# EAGLE design deska (EAGLE 7.7.0)
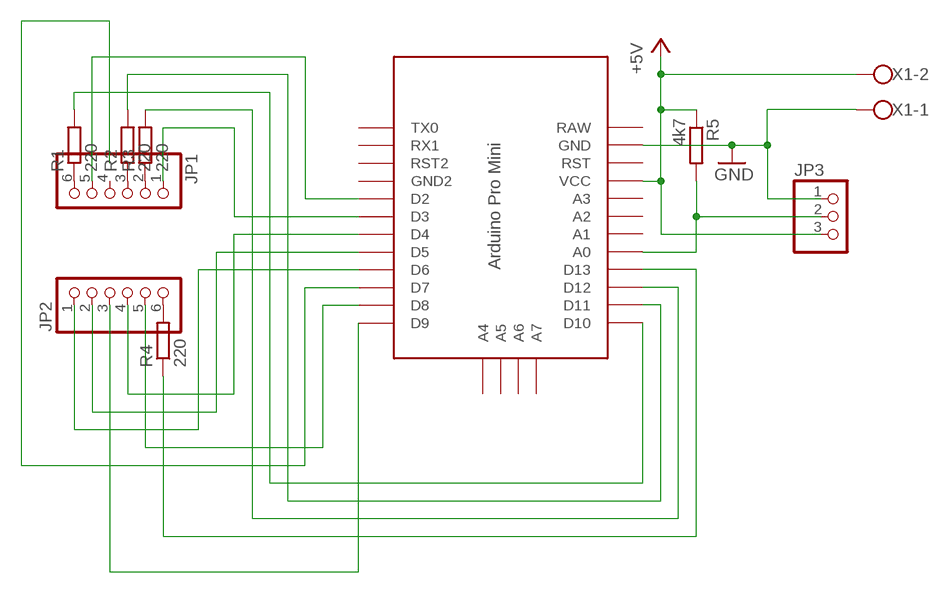
[diagram p0: schematic, sheet 1]

## Parts
JP1  PINHD-1X6  [1X06]
JP2  PINHD-1X6  [1X06]
JP3  PINHD-1X3  [1X03]
R1  220  R-EU_0204/7  [0204/7]
R2  220  R-EU_0204/7  [0204/7]
R3  220  R-EU_0204/7  [0204/7]
R4  220  R-EU_0204/7  [0204/7]
R5  4k7  R-EU_0204/7  [0204/7]
U$1  PRO-MINI  [PRO-MINI]
X1  W237-102  [W237-102]

## Nets
+5V: JP3.3 R5.1 U$1.VCC X1.2
GND: JP3.1 U$1.GND X1.1
N$1: JP1.6 R1.1
N$2: JP1.3 R2.1
N$3: JP1.2 R3.1
N$4: JP2.6 R4.2
N$5: R1.2 U$1.D10
N$6: R2.2 U$1.D11
N$7: R3.2 U$1.D12
N$8: R4.1 U$1.D13
N$9: JP1.5 U$1.D2
N$10: JP1.1 U$1.D3
N$11: JP2.4 U$1.D4
N$12: JP2.2 U$1.D5
N$13: JP2.1 U$1.D6
N$14: U$1.D7
N$15: JP2.5 U$1.D8
N$16: JP2.3 U$1.D9
N$17: JP3.2 R5.2 U$1.A0
Unconnected: JP1.4 U$1.A1 U$1.A2 U$1.A3 U$1.A4 U$1.A5 U$1.A6 U$1.A7 U$1.GND1(GND2) U$1.RST U$1.RST1(RST2) U$1.RX1 U$1.TX0

## Power pins joined to a net without a drawn wire
RAW: U$1.RAW

## Library data of the parts
JP1 JP2 = pinhead:PINHD-1X6: PIN HEADER
JP3 = pinhead:PINHD-1X3: PIN HEADER
R1-R5 = rcl:R-EU_: RESISTOR, European symbol
U$1 = Arduino-clone:PRO-MINI: Arduion Pro Mini Clone V1.0 www.betemcu.cu
X1 = con-wago-500:W237-102: WAGO SCREW CLAMP; MPN: 237-102; OC_FARNELL: unknown; OC_NEWARK: 70K9898

## Board
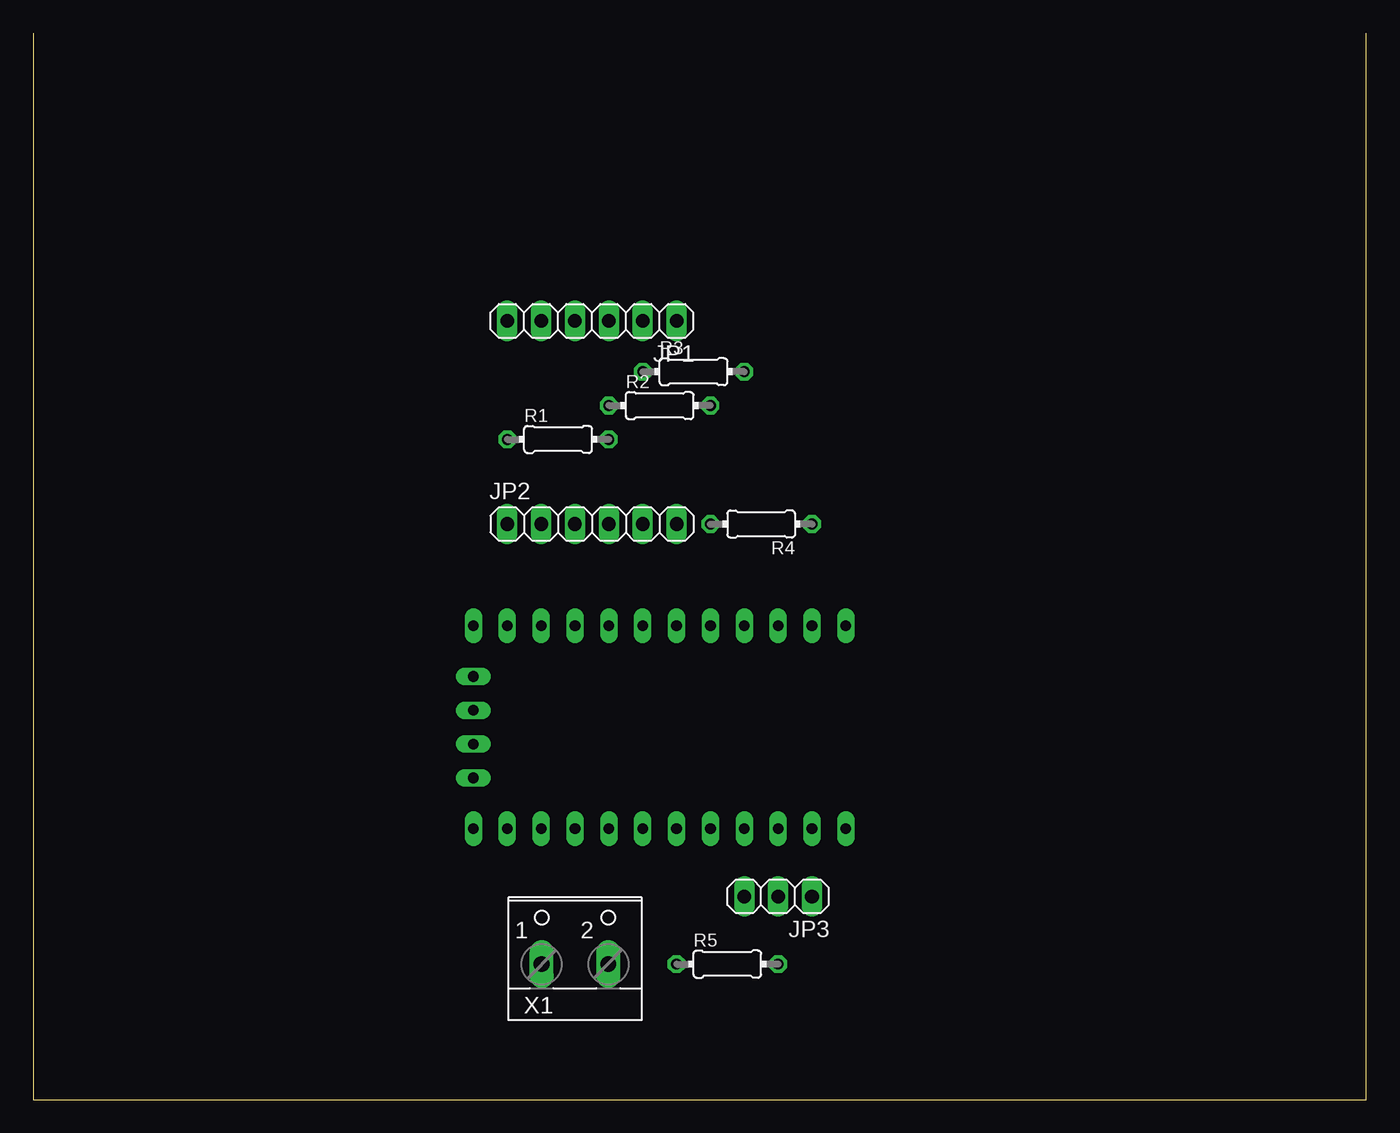
[diagram p1: board, top side]
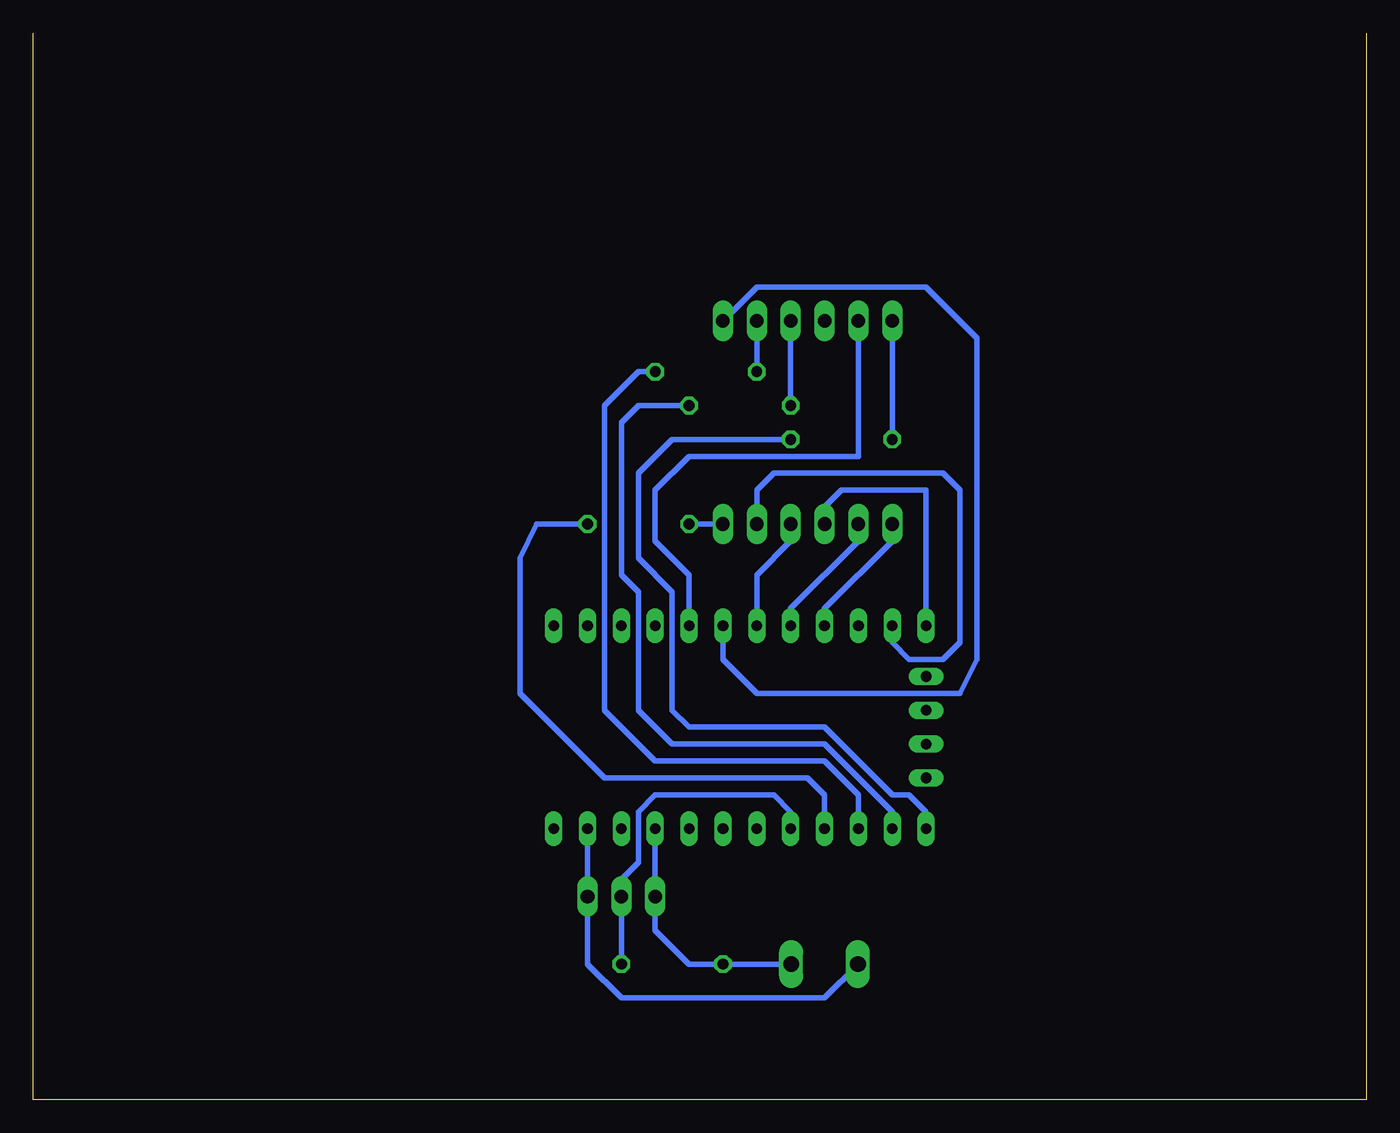
[diagram p2: board, bottom side, seen from below]

Size 100 x 80 mm. Coordinates in mm from the lower left corner, seen from the top.
Outline: 100,80 100,0 0,0 0,80
Copper layers (1*16): Top 0.035mm / dielectric 1.5mm / Bottom 0.035mm
Design rules "default": minimum track width 10mil, minimum drill 24mil, track to track 8mil, track to pad 8mil, pad to pad 8mil, via to via 8mil, smd to smd 8mil, copper to edge 40mil, drill to drill 8mil, minimum pad ring 10mil, minimum via ring 8mil, stop-mask expansion 4mil, vias tented up to drill 0mil, thermal gap 10mil

### Footprints (pad centres in the part's own frame; a part is rotated, then mirrored left to right if it is on the bottom)
1X06 = drill 1.016 long: 1 -6.35,0; 2 -3.81,0; 3 -1.27,0; 4 1.27,0; 5 3.81,0; 6 6.35,0
1X03 = drill 1.016 long: 1 -2.54,0; 2 0,0; 3 2.54,0
0204/7 = drill 0.813 octagon: 1 -3.81,0; 2 3.81,0
PRO-MINI = drill 0.8 long: A0 8.89,8.89; A1 8.89,11.43; A2 8.89,13.97; A3 8.89,16.51; A4 -2.54,-1.27; A5 0,-1.27; A6 2.54,-1.27; A7 5.08,-1.27; D2 -6.35,16.51; D3 -6.35,13.97; D4 -6.35,11.43; D5 -6.35,8.89; D6 -6.35,6.35; D7 -6.35,3.81; D8 -6.35,1.27; D9 -6.35,-1.27; D10 8.89,-1.27; D11 8.89,1.27; D12 8.89,3.81; D13 8.89,6.35; GND 8.89,24.13; GND1 -6.35,19.05; RAW 8.89,26.67; RST 8.89,21.59; RST1 -6.35,21.59; RX1 -6.35,24.13; TX0 -6.35,26.67; VCC 8.89,19.05
W237-102 = drill 1.194 long: 1 -2.5,-1.27; 2 2.5,-1.27

### Placement (x,y rotation side)
JP1  41.91,58.42 180 top
JP2  41.91,43.18 0 top
JP3  55.88,15.24 180 top
R1  39.37,49.53 0 top
R2  46.99,52.07 0 top
R3  49.53,54.61 0 top
R4  54.61,43.18 180 top
R5  52.07,10.16 0 top
U$1  34.29,29.21 270 top
X1  40.64,11.43 0 top

### Tracks (layer width: path | path; a pad name or v marks a point on that pad's centre or on a via)
+5V
  Bottom 0.406: U$1.VCC JP3.3 53.34,12.7 50.8,10.16 R5.1 X1.2
GND
  Bottom 0.406: U$1.GND JP3.1 58.42,10.16 55.88,7.62 40.64,7.62 38.14,10.12 X1.1
N$1
  Bottom 0.406: JP1.6 R1.1
N$2
  Bottom 0.406: JP1.3 R2.1
N$3
  Bottom 0.406: JP1.2 R3.1
N$4
  Bottom 0.406: JP2.6 R4.2
N$5
  Bottom 0.406: R1.2 52.07,49.53 54.61,46.99 54.61,40.64 52.07,38.1 52.07,29.21 50.8,27.94 40.64,27.94 35.56,22.86 34.29,22.86 33.02,21.59 U$1.D10
N$6
  Bottom 0.406: R2.2 54.61,52.07 55.88,50.8 55.88,39.37 54.61,38.1 54.61,29.21 52.07,26.67 40.64,26.67 35.56,21.59 U$1.D11
N$7
  Bottom 0.406: R3.2 54.61,54.61 57.15,52.07 57.15,29.21 53.34,25.4 40.64,25.4 38.1,22.86 U$1.D12
N$8
  Bottom 0.406: R4.1 62.23,43.18 63.5,40.64 63.5,30.48 57.15,24.13 41.91,24.13 40.64,22.86 U$1.D13
N$9
  Bottom 0.406: JP1.5 38.1,48.26 50.8,48.26 53.34,45.72 53.34,41.91 50.8,39.37 U$1.D2
N$10
  Bottom 0.406: JP1.1 45.72,60.96 33.02,60.96 29.21,57.15 29.21,33.02 30.48,30.48 45.72,30.48 48.26,33.02 U$1.D3
N$11
  Bottom 0.406: JP2.4 43.18,41.91 45.72,39.37 U$1.D4
N$12
  Bottom 0.406: JP2.2 38.1,41.91 43.18,36.83 U$1.D5
N$13
  Bottom 0.406: JP2.1 35.56,41.91 40.64,36.83 U$1.D6
N$15
  Bottom 0.406: U$1.D8 35.56,34.29 34.29,33.02 31.75,33.02 30.48,34.29 30.48,45.72 31.75,46.99 44.45,46.99 45.72,45.72 JP2.5
N$16
  Bottom 0.406: JP2.3 40.64,44.45 39.37,45.72 33.02,45.72 U$1.D9
N$17
  Bottom 0.406: R5.2 JP3.2 55.88,16.51 54.61,17.78 54.61,21.59 53.34,22.86 44.45,22.86 43.18,21.59 U$1.A0